# Altium schematic sheet MP2637.SchDoc
size A4
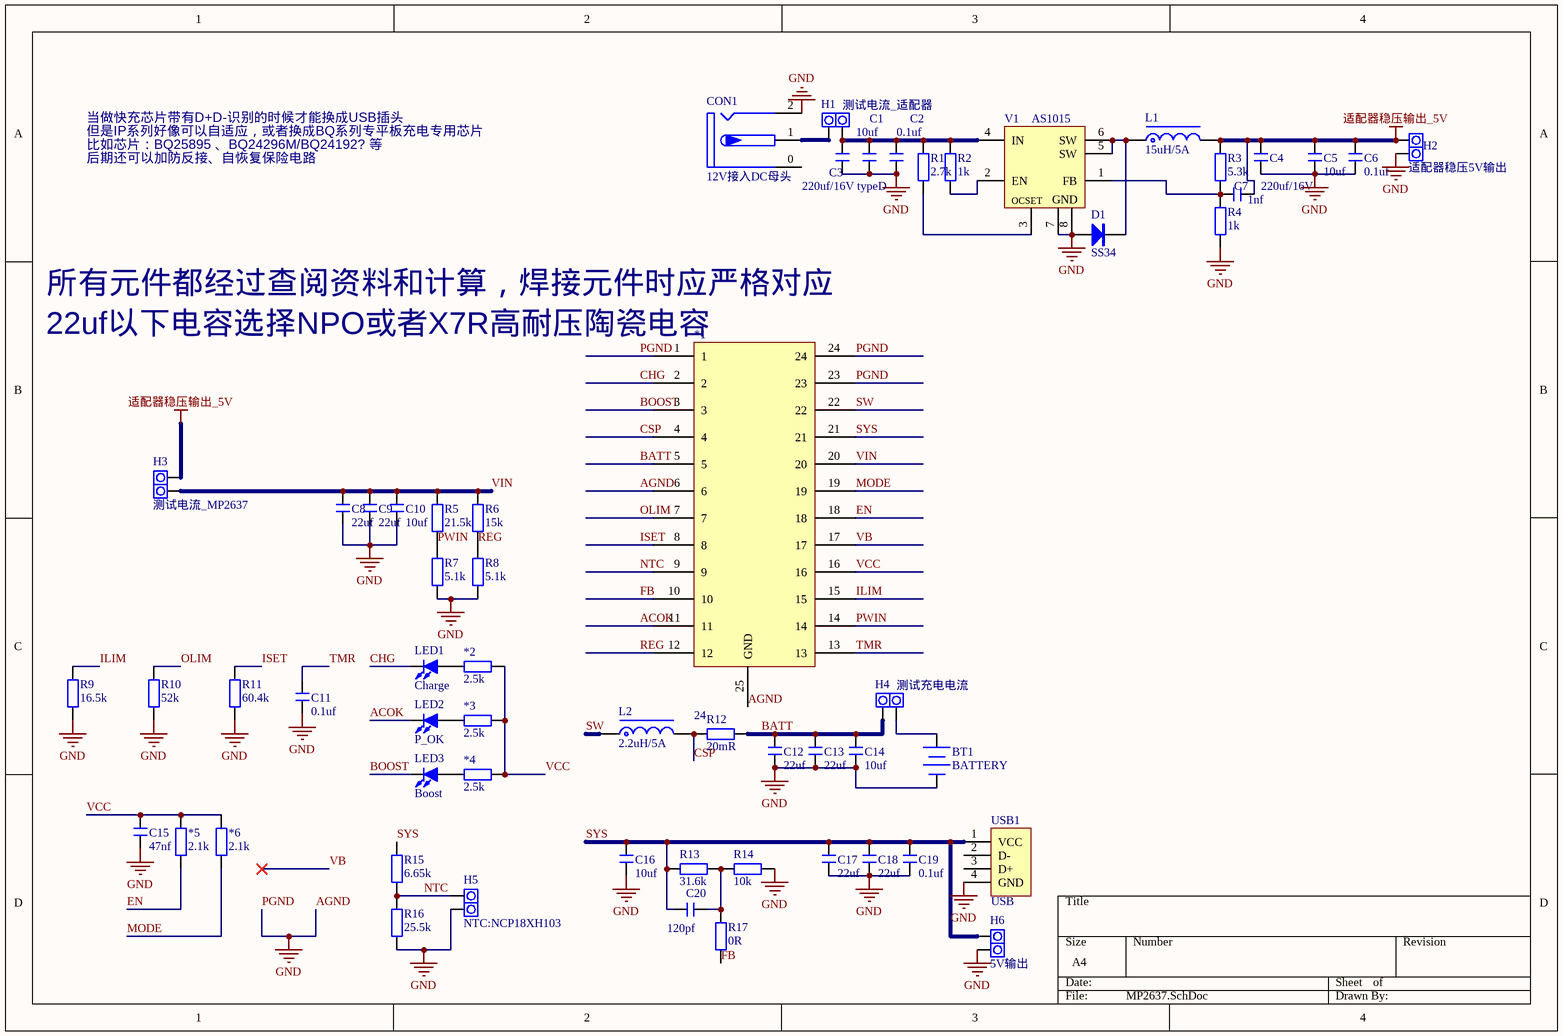
[diagram p0: MP2637.SchDoc]

## Parts
*1  24  [QFN24 4x4_M]
*2  2.5k  [R 0805_M]
*3  2.5k  [R 0805_M]
*4  2.5k  [R 0805_M]
*5  2.1k  [R 0805_M]
*6  2.1k  [R 0805_M]
BT1  BATTERY  [BAT-2]
C1  10uf  [C 0805_M]
C2  0.1uf  [C 0805_M]
C3  220uf/16V typeD  [CD D(7343)]
C4  220uf/16V  [CD D(7343)]
C5  10uf  [C 0805_M]
C6  0.1uf  [C 0805_M]
C7  1nf  [C 0805_M]
C8  22uf  [C 0805_M]
C9  22uf  [C 0805_M]
C10  10uf  [C 0805_M]
C11  0.1uf  [C 0805_M]
C12  22uf  [C 0805_M]
C13  22uf  [C 0805_M]
C14  10uf  [C 0805_M]
C15  47nf  [C 0805_M]
C16  10uf  [C 0805_M]
C17  22uf  [C 0805_M]
C18  22uf  [C 0805_M]
C19  0.1uf  [C 0805_M]
C20  120pf  [C 0805_M]
CON1  12V接入DC母头  [DC-005P]
D1  SS34  [SMA]
H1  测试电流_适配器  [PAD2-2.54]
H2  适配器稳压5V输出  [PAD2-2.54]
H3  测试电流_MP2637  [PAD2-2.54]
H4  测试充电电流  [PAD2-2.54]
H5  NTC:NCP18XH103  [PAD2-2.54]
H6  5V输出  [PAD2-2.54]
L1  15uH/5A  [L-SMD-0630]
L2  2.2uH/5A  [L-SMD-0630]
LED1  Charge  [LED 0805G]
LED2  P_OK  [LED 0805G]
LED3  Boost  [LED 0805G]
R1  2.7k  [R 0805_M]
R2  1k  [R 0805_M]
R3  5.3k  [R 0805_M]
R4  1k  [R 0805_M]
R5  21.5k  [R 0805_M]
R6  15k  [R 0805_M]
R7  5.1k  [R 0805_M]
R8  5.1k  [R 0805_M]
R9  16.5k  [R 0805_M]
R10  52k  [R 0805_M]
R11  60.4k  [R 0805_M]
R12  20mR  [R 2512-HP_L]
R13  31.6k  [R 0805_M]
R14  10k  [R 0805_M]
R15  6.65k  [R 0805_M]
R16  25.5k  [R 0805_M]
R17  0R  [R 0805_M]
USB1  USB  [USB-A/S_A]
V1  AS1015  [SOP8_N]

## Nets
AGND: *1.1 *1.6 *1.23 *1.24 *1.25(GND) BT1.2(-) C1.1 C2.1 C3.1 C4.1 C5.1 C6.1 C8.1 C9.1 C10.1 C11.1 C12.1 C13.1 C14.1 C15.1 C16.1 C17.1 C18.1 C19.1 CON1.2 D1.1(A) H2.2 H5.2 H6.2 R4.2 R7.2 R8.2 R9.2 R10.1 R11.1 R14.2 R16.2 USB1.4(GND) V1.7(GND) V1.8(GND)  [also labelled GND, PGND]
适配器稳压输出_5V: C4.2 C5.2 C6.2 C7.1 H2.1 H3.2 L1.2 R3.1
ACOK: *1.11 LED2.2(K)
BATT: *1.5 C12.2 C13.2 C14.2 H4.1 R12.2
BOOST: *1.3 LED3.2(K)
CHG: *1.2 LED1.2(K)
CSP: *1.4 L2.2 R12.1
EN: *1.18 *5.2
FB: *1.10 R17.1
ILIM: *1.15 R9.1
ISET: *1.8 R11.2
MODE: *1.19 *6.2
NTC: *1.9 H5.1 R15.2 R16.1
OLIM: *1.7 R10.2
PWIN: *1.14 R5.2 R7.1
REG: *1.12 R6.2 R8.1
SW: *1.22 L2.1
SYS: *1.21 C16.2 C17.2 C18.2 C19.2 C20.1 H6.1 R13.1 R15.1 USB1.1(VCC)
TMR: *1.13 C11.2
VB: *1.17
VCC: *1.16 *2.2 *3.2 *4.2 *5.1 *6.1 C15.2
VIN: *1.20 C8.2 C9.2 C10.2 H3.1 R5.1 R6.1
Net*2_1: *2.1 LED1.1(A)
Net*3_1: *3.1 LED2.1(A)
Net*4_1: *4.1 LED3.1(A)
NetBT1_1: BT1.1(+) H4.2
NetC1_2: C1.2 C2.2 C3.2 H1.2 R1.1 R2.1 V1.4(IN)
NetC7_2: C7.2 R3.2 R4.1 V1.1(FB)
NetC20_2: C20.2 R13.2 R14.1 R17.2
NetCON1_1: CON1.1 H1.1
NetD1_2: D1.2(K) L1.1 V1.5(SW) V1.6(SW)
NetR1_2: R1.2 V1.3(OCSET)
NetR2_2: R2.2 V1.2(EN)

Not connected (* = marked no-connect by the designer): CON1 0; USB1 2(D-) 3(D+)

## Notes on the sheet
- 当做快充芯片带有D+D-识别的时候才能换成USB插头
- 但是IP系列好像可以自适应，或者换成BQ系列专平板充电专用芯片
- 比如芯片：BQ25895 、BQ24296M/BQ24192? 等
- 后期还可以加防反接、自恢复保险电路
- 所有元件都经过查阅资料和计算，焊接元件时应严格对应
- 22uf以下电容选择NPO或者X7R高耐压陶瓷电容

## Library data of the parts
*2-*6 R1-R17 = R: 贴片电阻; 版权归属: 源创客; BOM名称: 贴片电阻; 学习资源: www.ooocke.com
BT1 = BATTERY: Multicell Battery; Published: 24-Mar-1999; LatestRevisionDate: 17-Jul-2002; LatestRevisionNote: Re-released for DXP Platform.; PackageReference: BAT-2; Publisher: Altium Limited
C1-C20 = C: 无极性贴片电容; 版权归属: 源创客; BOM名称: 无极性贴片电容; 学习资源: www.ooocke.com
CON1 = DC-005P: 带屏蔽DC电源接口; 版权归属: 源创客; BOM名称: 带屏蔽DC电源接口; 学习资源: www.ooocke.com
D1 = SS34: 肖特基二极管; 版权归属: 源创客; 属性: 40V/3A; BOM名称: 肖特基二极管; 学习资源: www.ooocke.com
H1-H6 = PAD2: 引线焊盘; 版权归属: 源创客; BOM名称: 引线焊盘; 学习资源: www.ooocke.com
L1 L2 = L-CDRH: 功率屏蔽电感; 版权归属: 源创客; BOM名称: 功率屏蔽电感; 学习资源: www.ooocke.com
LED1-LED3 = LED-SMD: 贴片LED; 版权归属: 源创客; BOM名称: 贴片LED; 学习资源: www.ooocke.com
USB1 = USB-A/S: USB-A型母接口; 版权归属: 源创客; BOM名称: USB-A型母接口; 学习资源: www.ooocke.com
V1 = AS1015: 可调升压芯片; 版权归属: 源创客; BOM名称: 可调升压芯片; 学习资源: www.ooocke.com